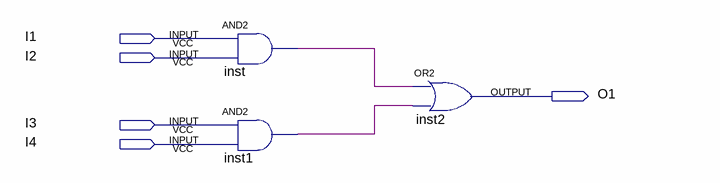
[diagram p0: schematic sheet]
// Quartus schematic Entradas.bdf as structural Verilog: 3 symbols, 5 pins
module Entradas (
  input  I1,
  input  I2,
  input  I3,
  input  I4,
  output O1
);

  wire inst1_out, inst_out;

  and inst (inst_out, I1, I2);
  and inst1 (inst1_out, I3, I4);
  or inst2 (O1, inst_out, inst1_out);
endmodule
